# Altium project PCB_Project1.PrjPCB
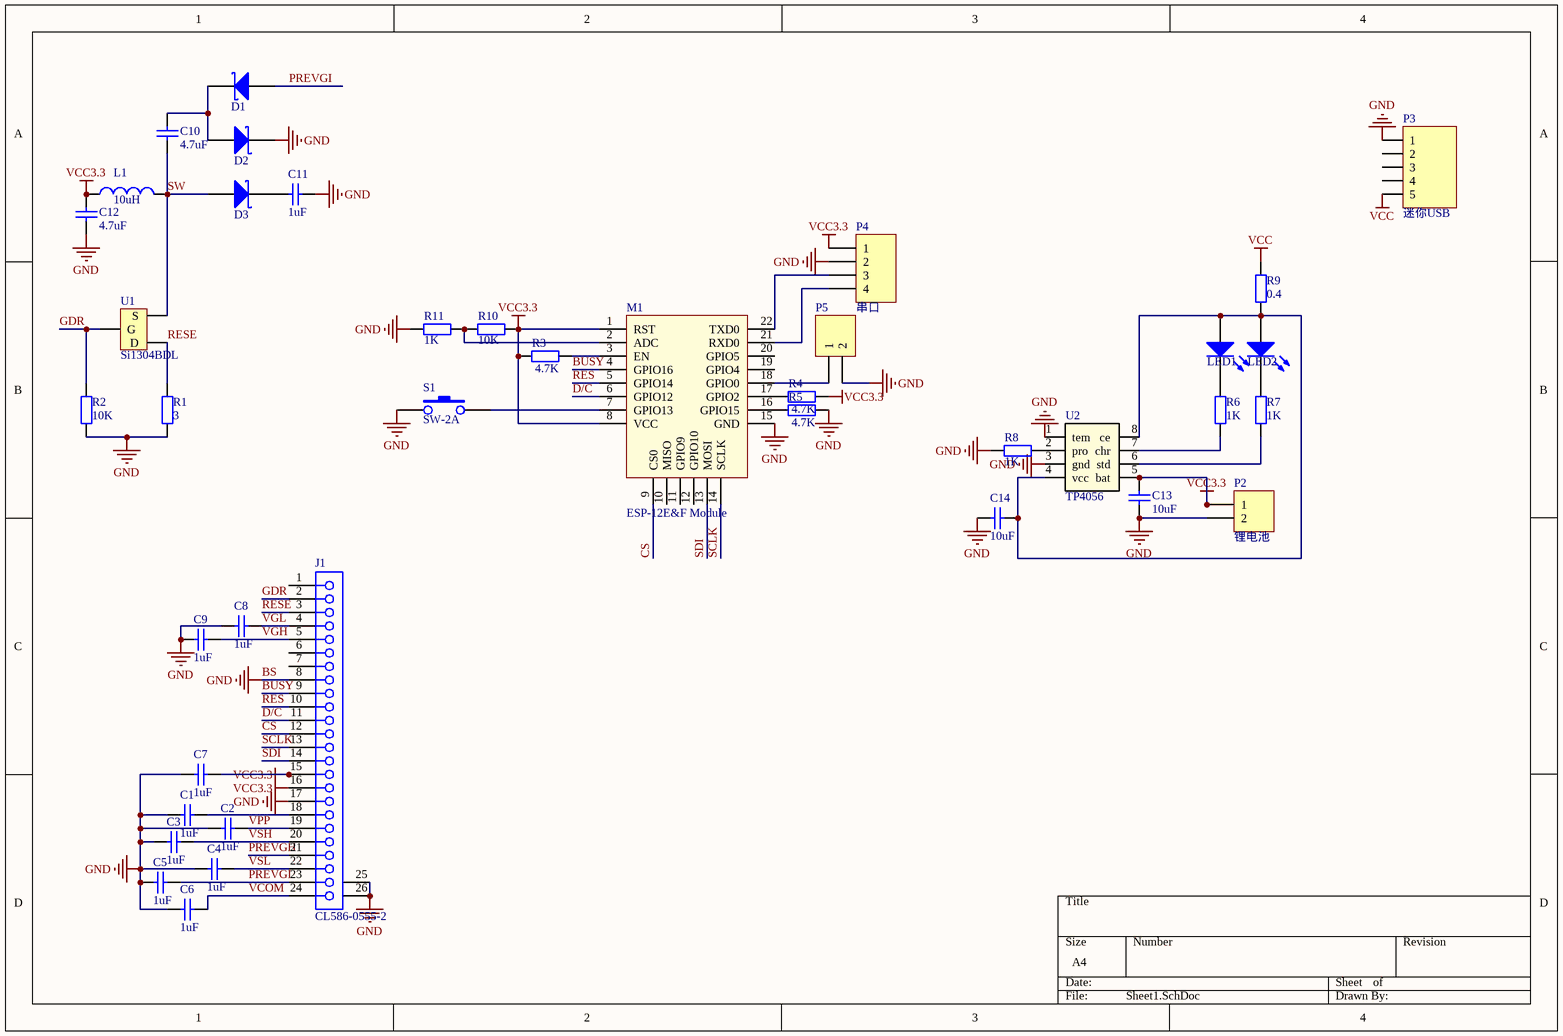
[diagram p0: Sheet1.SchDoc]
1 sheet, 40 parts. Net scope: global (net labels, ports and power ports of the same name join across sheets).

## Sheet Sheet1.SchDoc
size A4

### Parts
C1  value 1uF  [0805C]  (hidden comment: 无极性电容)
C2  value 1uF  [0805C]  (hidden comment: 无极性电容)
C3  value 1uF  [0805C]  (hidden comment: 无极性电容)
C4  value 1uF  [0805C]  (hidden comment: 无极性电容)
C5  value 1uF  [0805C]  (hidden comment: 无极性电容)
C6  value 1uF  [0805C]  (hidden comment: 无极性电容)
C7  value 1uF  [0805C]  (hidden comment: 无极性电容)
C8  value 1uF  [0805C]  (hidden comment: 无极性电容)
C9  value 1uF  [0805C]  (hidden comment: 无极性电容)
C10  value 4.7uF  [0805C]  (hidden comment: 无极性电容)
C11  value 1uF  [0805C]  (hidden comment: 无极性电容)
C12  value 4.7uF  [0805C]  (hidden comment: 无极性电容)
C13  value 10uF  [0805C]  (hidden comment: 无极性电容)
C14  value 10uF  [0805C]  (hidden comment: 无极性电容)
D1  1N5817-肖特基二极管_1  [SOD123]  (value not drawn)
D2  1N5817-肖特基二极管_1  [SOD123]  (value not drawn)
D3  1N5817-肖特基二极管_1  [SOD123]  (value not drawn)
J1  CL586-0555-2  [FH12-24S-0.5SH]
L1  value 10uH  [CAPM-B-3528X21N]  (hidden comment: Inductor)
LED1  LED-贴片-直插  [LED_0805]  (value not drawn)
LED2  LED-贴片-直插  [LED_0805]  (value not drawn)
M1  ESP-12E&F Module  [ESP-12E&F Module]
P2  锂电池  [HDR1X2]
P3  迷你USB  [迷你usb]
P4  串口  [HDR1X4]
P5  (no value)  [HDR1X2]
R1  value 3  [0805R]  (hidden comment: 贴片电阻)
R2  value 10K  [0805R]  (hidden comment: 贴片电阻)
R3  value 4.7K  [0805R]  (hidden comment: 贴片电阻)
R4  value 4.7K  [0805R]  (hidden comment: 贴片电阻)
R5  value 4.7K  [0805R]  (hidden comment: 贴片电阻)
R6  value 1K  [0805R]  (hidden comment: 贴片电阻)
R7  value 1K  [0805R]  (hidden comment: 贴片电阻)
R8  value 1K  [0805R]  (hidden comment: 贴片电阻)
R9  value 0.4  [0805R]  (hidden comment: 贴片电阻)
R10  value 10K  [0805R]  (hidden comment: 贴片电阻)
R11  value 1K  [0805R]  (hidden comment: 贴片电阻)
S1  SW-2A  [SW贴片-3*6*2.5]
U1  Si1304BDL  [AO3400]
U2  TP4056  [SOP8LM386]

### Nets
BS: C1.1 C2.1 C3.1 C4.1 C5.1 C6.1 C7.1 C8.1 C9.1 C11.1 C12.1 C13.1 C14.2 D2.2(K) J1.8 J1.17 J1.25(MH1) J1.26(MH2) M1.15(GND) P2.2 P3.1 P4.2 P5.2 R1.1 R2.1 R5.1 R8.1 R11.1 S1.1 U2.1(tem) U2.3(gnd)  [also labelled GND]
VCC: P3.5 R9.2
VCC3.3: C7.2 C12.2 C13.2 J1.15 J1.16 L1.1 M1.1(RST) M1.8(VCC) P2.1 P4.1 R3.2 R4.1 R10.2 U2.5(bat)
BUSY: J1.9 M1.4(GPIO16)
CS: J1.12 M1.9(CS0)
D/C: J1.11 M1.6(GPIO12)
GDR: J1.2 R2.2 U1.1(G)
PREVGH: J1.21
PREVGI: C5.2 D1.1(A) J1.23
RES: J1.10 M1.5(GPIO14)
RESE: J1.3 R1.2 U1.3(D)
SCLK: J1.13 M1.14(SCLK)
SDI: J1.14 M1.13(MOSI)
SW: C10.1 D3.1(A) L1.2 U1.2(S)
VCOM: C6.2 J1.24
VGH: C9.2 J1.5
VGL: C8.2 J1.4
VPP: C2.2 J1.19
VSH: C3.2 J1.20
VSL: C4.2 J1.22
NetC1_2: C1.2 J1.18
NetC10_2: C10.2 D1.2(K) D2.1(A)
NetC11_2: C11.2 D3.2(K)
NetC14_1: C14.1 LED1.1(A) LED2.1(A) R9.1 U2.4(vcc) U2.8(ce)
NetLED1_2: LED1.2(K) R6.1
NetLED2_2: LED2.2(K) R7.1
NetM1_2: M1.2(ADC) R10.1 R11.2
NetM1_3: M1.3(EN) R3.1
NetM1_7: M1.7(GPIO13) S1.2
NetM1_16: M1.16(GPIO15) R5.2
NetM1_17: M1.17(GPIO2) R4.2
NetM1_18: M1.18(GPIO0) P5.1
NetM1_21: M1.21(RXD0) P4.4
NetM1_22: M1.22(TXD0) P4.3
NetR6_2: R6.2 U2.7(chr)
NetR7_2: R7.2 U2.6(std)
NetR8_2: R8.2 U2.2(pro)

Not connected (* = marked no-connect by the designer): J1 1 6 7; M1 10(MISO) 11(GPIO9) 12(GPIO10) 19(GPIO4) 20(GPIO5); P3 2 3 4

### Library data of the parts
C1-C14 = 无极性电容: Capacitor; Published: 8-Jun-2000; LatestRevisionDate: 17-Jul-2002; LatestRevisionNote: Re-released for DXP Platform.; PackageReference: RAD-0.3; Publisher: Altium Limited; PackageDescription: Radial Cap, Thru-Hole; 2 Leads; 0.3 in Pin Spacing
J1 = CL586-0555-2: FH12 Series, "Flip-Lock" SMT/ZIF Connector - 0.5mm Spaced Top Contact; Positions: 24; ContactMaterial: Phosphor Bronze; Current: 0.4A; PCB_Layout: Complies with manufacturer's recommendation.; Note: Pad dimensions follow nominal values, Suitable for Wave Soldering, Adjust for Re-flow.; Published: 17-Jul-2002; DatasheetDocument: 13-Nov-2000; PackageDocument: 13-Nov-2000; PackageReference: FH12A-24S-0.5SH; Publisher: Altium Limited; ComponentLink1Description: Manufacturer Link; ComponentLink1URL: http://www.hiroseusa.com/; ComponentLink2Description: Datasheet; ComponentLink2URL: http://www.hirose.co.jp/cataloge_hp/e58605370.pdf
L1 = Inductor: Code_IEC: 1005; Published: 8-Jun-2000; LatestRevisionDate: 17-Jul-2002; LatestRevisionNote: Re-released for DXP Platform.; PackageReference: 0402-A; Publisher: Altium Limited; Code_JEITA: 0402
P2 P5 = Header 2: Header, 2-Pin; LatestRevisionDate: 17-Jul-2002; LatestRevisionNote: Re-released for DXP Platform.; Publisher: Altium Limited
P4 = Header 4: Header, 4-Pin; LatestRevisionDate: 17-Jul-2002; LatestRevisionNote: Re-released for DXP Platform.; Publisher: Altium Limited
R1-R11 = 贴片电阻: Resistor; Published: 8-Jun-2000; LatestRevisionDate: 17-Jul-2002; LatestRevisionNote: Re-released for DXP Platform.; PackageReference: AXIAL-0.4; Publisher: Altium Limited; PackageDescription: Axial Device, Thru-Hole; 2 Leads; 0.4 in Pin Spacing
U1 = AO3400